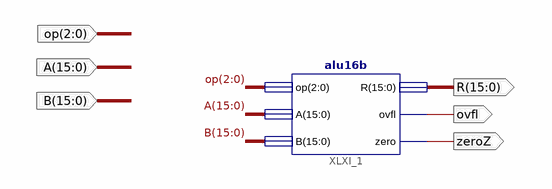
[diagram p0: schematic sheet 1]
// Xilinx ISE schematic testALU.sch (spartan3e) as structural Verilog: 1 symbols, 6 ports
module testALU (
  input  [2:0] op,
  input  [15:0] A,
  input  [15:0] B,
  output [15:0] R,
  output ovfl,
  output zeroZ
);

  alu16b XLXI_1 (.op(op), .A(A), .B(B), .R(R), .ovfl(ovfl), .zero(zeroZ));
endmodule
